# Altium schematic sheet Sensors.SchDoc
size A4; SheetNumber: 4; SheetTotal: 6; SPICEModelCacheKLIENLUT: <root> / <DocumentId>KLIENLUT</DocumentId> / <CacheFrame Number="0"> / <Model Name="0603_885012206071_100nf" Kind="CKT"> / <Text>******* / .subckt 0603_885012206071_100nF 1 2 / Rser 1 3 0.025 / Lser 2 4 0.0000000008 / C1 3 4 0.0000001 / Rpar 3 4 5000000000 / .ends 0603_885012206071_100nF</Text> / </Model> / <Model Name="0603_885012106012_4.7uf" Kind="CKT"> / <Text>******* / .subckt 0603_885012106012_4.7uF 1 2 / Rser 1 3 0.00455496693599 / Lser 2 4 5.03384516E-10 / C1 3 4 0.0000047 / Rpar 3 4 20000000 / .ends 0603_885012106012_4.7uF</Text> / </Model> / <Model Name="0603_885012206020_100nf" Kind="CKT"> / <Text>******* / .subckt 0603_885012206020_100nF 1 2 / Rser 1 3 0.0188883213835 / Lser 2 4 4.53593763E-10 / C1 3 4 0.0000001 / Rpar 3 4 5000000000 / .ends 0603_885012206020_100nF</Text> / </Model> / </CacheFrame> / </root>
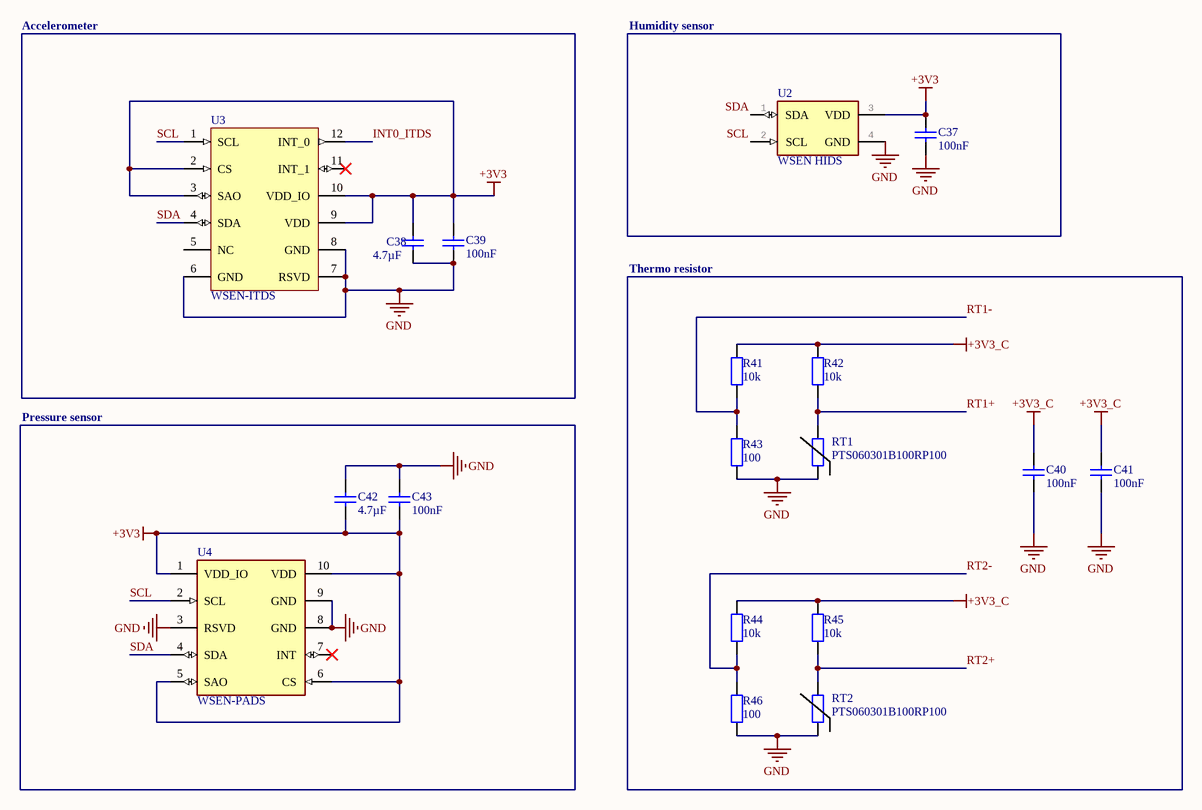
[diagram p0: Sensors.SchDoc]

## Parts
C37  value 100nF  [WCAP-CSGP_0603_L1.6W0.8H0.8_Reflow]  (hidden comment: 885012206071)
C38  value 4.7µF  [WCAP-CSGP_0603_L1.6W0.8H0.8_Reflow]  (hidden comment: 885012106012)
C39  value 100nF  [WCAP-CSGP_0603_L1.6W0.8H0.8_Reflow]  (hidden comment: 885012206071)
C40  value 100nF  [WCAP-CSGP_0603_L1.6W0.8H0.8_Reflow]  (hidden comment: 885012206020)
C41  value 100nF  [WCAP-CSGP_0603_L1.6W0.8H0.8_Reflow]  (hidden comment: 885012206020)
C42  value 4.7µF  [WCAP-CSGP_0603_L1.6W0.8H0.8_Reflow]  (hidden comment: 885012106012)
C43  value 100nF  [WCAP-CSGP_0603_L1.6W0.8H0.8_Reflow]  (hidden comment: 885012206071)
R41  value 10k  [WRIS-RSKS_0603_Reflow]  (hidden comment: 560112116005)
R42  value 10k  [WRIS-RSKS_0603_Reflow]  (hidden comment: 560112116005)
R43  value 100  [WRIS-RSKS_0603_Reflow]  (hidden comment: 560112116009)
R44  value 10k  [WRIS-RSKS_0603_Reflow]  (hidden comment: 560112116005)
R45  value 10k  [WRIS-RSKS_0603_Reflow]  (hidden comment: 560112116005)
R46  value 100  [WRIS-RSKS_0603_Reflow]  (hidden comment: 560112116009)
RT1  PTS060301B100RP100  [PTS060301B100RP100-Footprint-1]
RT2  PTS060301B100RP100  [PTS060301B100RP100-Footprint-1]
U2  WSEN HIDS  [WSEN HIDS-Footprint-1]
U3  WSEN-ITDS  [WSEN-ITDS-Footprint-1]
U4  WSEN-PADS  [WSEN-PADS-Footprint-1]

## Blocks framed on the sheet
Accelerometer: C38 C39 U3
Humidity sensor: C37 U2
Thermo resistor: C40 C41 R41-R46 RT1 RT2
Pressure sensor: C42 C43 U4

## Nets
+3V3: C37.2 C38.1 C39.2 C42.2 C43.1 U2.3(VDD) U3.2(CS) U3.3(SAO) U3.9(VDD) U3.10(VDD_IO) U4.1(VDD_IO) U4.5(SAO) U4.6(CS) U4.10(VDD)
+3V3_C: C40.2 C41.2 R41.2 R42.2 R44.2 R45.2
GND: C37.1 C38.2 C39.1 C40.1 C41.1 C42.1 C43.2 R43.1 R46.1 RT1.1 RT2.1 U2.4(GND) U3.6(GND) U3.7(RSVD) U3.8(GND) U4.3(RSVD) U4.8(GND) U4.9(GND)
INT0_ITDS: U3.12(INT_0)
RT1+: R42.1 RT1.2
RT1-: R41.1 R43.2
RT2+: R45.1 RT2.2
RT2-: R44.1 R46.2
SCL: U2.2(SCL) U3.1(SCL) U4.2(SCL)
SDA: U2.1(SDA) U3.4(SDA) U4.4(SDA)

Not connected (* = marked no-connect by the designer): U3 5(NC) 11(INT_1)*; U4 7(INT)*

## Library data of the parts
C37 C39 C43 = CMP-001-00661-1: WCAP-CSGP Multilayer Ceramic Chip Capacitor, General Purpose, size 0603, X7R, 100nF, 25VDC; Manufacturer: Wurth Elektronik; Dissipation Factor: 3.5%; Capacitance Tolerance: +/-10%; Insulation Resistance: 5GOhm; Technical Reference: X7R0603104K025DFCT10000; Rated Voltage (DC): 25V; Packaging: Tape and Reel; Height: 0.8mm; Mount: Surface Mount; Source: WCAP-CSGP.SchLib; Component Type: Standard; Category: Multilayer Ceramic Chip Capacitors; Operating Temperature Min: -55°C; Case/Package: 0603; ComponentLink2Description: Datasheet Link; Width: 0.8mm; ComponentLink1URL: https://www.we-online.com/redexpert/article/885012206071?ad; Length: 1.6mm; Operating Temperature Max: 125°C; Match Code: WCAP-CSGP; ComponentLink2URL: https://www.we-online.com/redexpert/spec/885012206071?ad; Design Item ID: 885012206071; ComponentLink1Description: Website Link; Manufacturer Part Number: 885012206071; Pins: 2; Ceramic Type: X7R
C38 C42 = CMP-001-00440-1: WCAP-CSGP Multilayer Ceramic Chip Capacitor, General Purpose, size 0603, X5R, 4.7uF, 10VDC; Manufacturer: Wurth Elektronik; Rated Voltage (DC): 10V; Technical Reference: X5R0603475M010DFCT10000; Dissipation Factor: 10%; Insulation Resistance: 0.02GOhm; Capacitance Tolerance: +/-20%; ComponentLink2URL: https://www.we-online.com/redexpert/spec/885012106012?ad; Height: 0.8mm; Packaging: Tape and Reel; Case/Package: 0603; Manufacturer Part Number: 885012106012; Component Type: Standard; Width: 0.8mm; Match Code: WCAP-CSGP; Mount: Surface Mount; Ceramic Type: X5R; Operating Temperature Max: 85°C; ComponentLink1Description: Website Link; Length: 1.6mm; ComponentLink1URL: https://www.we-online.com/redexpert/article/885012106012?ad; ComponentLink2Description: Datasheet Link; Category: Multilayer Ceramic Chip Capacitors; Source: WCAP-CSGP.SchLib; Operating Temperature Min: -55°C; Pins: 2; Design Item ID: 885012106012
C40 C41 = CMP-001-00610-1: WCAP-CSGP Multilayer Ceramic Chip Capacitor, General Purpose, size 0603, X7R, 100nF, 10VDC; Manufacturer: Wurth Elektronik; Capacitance Tolerance: +/-10%; Technical Reference: X7R0603104K010DFCT10000; Insulation Resistance: 5GOhm; Rated Voltage (DC): 10V; Dissipation Factor: 5%; Operating Temperature Min: -55°C; Source: WCAP-CSGP.SchLib; Width: 0.8mm; Pins: 2; Category: Multilayer Ceramic Chip Capacitors; Manufacturer Part Number: 885012206020; Case/Package: 0603; ComponentLink1URL: https://www.we-online.com/redexpert/article/885012206020?ad; Length: 1.6mm; Height: 0.8mm; Component Type: Standard; Match Code: WCAP-CSGP; Design Item ID: 885012206020; ComponentLink2URL: https://www.we-online.com/redexpert/spec/885012206020?ad; Mount: Surface Mount; Packaging: Tape and Reel; Operating Temperature Max: 125°C; Ceramic Type: X7R; ComponentLink2Description: Datasheet Link; ComponentLink1Description: Website Link
R41 R42 R44 R45 = CMP-009-00328-1: WRIS-RSKS Thick Film Resistor, size 0603, 10000Ohm, 100mW; Manufacturer: Wurth Elektronik; Limiting Element Voltage: 75V; Temperature Coefficient of Resistance Max: 100ppm/°C; Resistance Tolerance: +/-1%; Temperature Coefficient of Resistance Min: -100ppm/°C; ComponentLink1Description: Website Link; Case/Package: 0603; Pins: 2; Match Code: WRIS-RSKS; Operating Temperature Max: 155°C; Width: 0.8mm; Design Item ID: 560112116005; Length: 1.6mm; ComponentLink2Description: Datasheet Link; ComponentLink2URL: https://www.we-online.com/redexpert/spec/560112116005?ad; Packaging: Tape and Reel; Source: WRIS-RSKS.SchLib; Height: 0.45mm; Manufacturer Part Number: 560112116005; Component Type: Standard; Mount: Surface Mount; Operating Temperature Min: -55°C; Rated Power: 100mW; ComponentLink1URL: https://www.we-online.com/redexpert/article/560112116005?ad; Category: Thick Film Resistors
R43 R46 = CMP-009-00332-1: WRIS-RSKS Thick Film Resistor, size 0603, 100Ohm, 100mW; Manufacturer: Wurth Elektronik; Limiting Element Voltage: 75V; Resistance Tolerance: +/-1%; Temperature Coefficient of Resistance Max: 100ppm/°C; Temperature Coefficient of Resistance Min: -100ppm/°C; Mount: Surface Mount; Design Item ID: 560112116009; Height: 0.45mm; Category: Thick Film Resistors; Operating Temperature Min: -55°C; Width: 0.8mm; Manufacturer Part Number: 560112116009; ComponentLink2Description: Datasheet Link; Pins: 2; ComponentLink2URL: https://www.we-online.com/redexpert/spec/560112116009?ad; Component Type: Standard; Case/Package: 0603; ComponentLink1URL: https://www.we-online.com/redexpert/article/560112116009?ad; Rated Power: 100mW; ComponentLink1Description: Website Link; Operating Temperature Max: 155°C; Source: WRIS-RSKS.SchLib; Packaging: Tape and Reel; Length: 1.6mm; Match Code: WRIS-RSKS
RT1 RT2 = CMP-010-00008-1: RTD Platinum Sensor, 100ohm, Rectangular, Surface Mount; Sensor Type: TEMPERATURE SENSOR,RTD,PLATINUM; RoHS Compliant: Yes; Mounting Technology: Surface Mount; Min Operating Temperature: -55°C; Max Operating Temperature: 155°C; Case/Package: 0603
U2 = CMP-011-00001-1: Wsen-hids/ Humidity, temperature Sensor
U3 = CMP-010-00006-1: IMU (3 axis)
U4 = CMP-010-00002-1: Piezoresistive Sensor, Absolute pressure sensor; RoHS Compliant: Yes